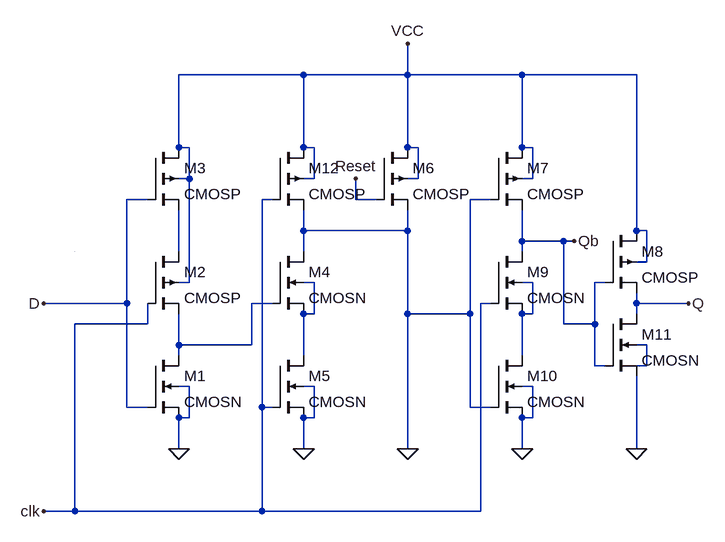
[diagram p0: schematic Draft6.asc]
Draft6.asc, the LTspice schematic file:
Version 4
SHEET 1 980 680
WIRE 352 -272 160 -272
WIRE 512 -272 512 -320
WIRE 512 -272 352 -272
WIRE 688 -272 512 -272
WIRE 864 -272 688 -272
WIRE 160 -160 160 -272
WIRE 176 -160 160 -160
WIRE 352 -160 352 -272
WIRE 368 -160 352 -160
WIRE 512 -160 512 -272
WIRE 528 -160 512 -160
WIRE 688 -160 688 -272
WIRE 704 -160 688 -160
WIRE 176 -112 176 -160
WIRE 176 -112 160 -112
WIRE 368 -112 368 -160
WIRE 368 -112 352 -112
WIRE 528 -112 528 -160
WIRE 528 -112 512 -112
WIRE 704 -112 704 -160
WIRE 704 -112 688 -112
WIRE 112 -80 80 -80
WIRE 304 -80 288 -80
WIRE 432 -80 432 -112
WIRE 464 -80 432 -80
WIRE 640 -80 608 -80
WIRE 352 -32 352 -64
WIRE 512 -32 512 -64
WIRE 512 -32 352 -32
WIRE 864 -32 864 -272
WIRE 880 -32 864 -32
WIRE 688 -16 688 -64
WIRE 752 -16 688 -16
WIRE 768 -16 752 -16
WIRE 160 0 160 -64
WIRE 352 0 352 -32
WIRE 688 0 688 -16
WIRE 880 16 880 -32
WIRE 880 16 864 16
WIRE 176 48 176 -112
WIRE 176 48 160 48
WIRE 368 48 352 48
WIRE 704 48 688 48
WIRE 816 48 800 48
WIRE 80 80 80 -80
WIRE 80 80 -48 80
WIRE 304 80 272 80
WIRE 640 80 624 80
WIRE 864 80 864 64
WIRE 944 80 864 80
WIRE 368 96 368 48
WIRE 368 96 352 96
WIRE 512 96 512 -32
WIRE 608 96 608 -80
WIRE 608 96 512 96
WIRE 704 96 704 48
WIRE 704 96 688 96
WIRE 864 96 864 80
WIRE 112 112 112 80
WIRE 112 112 0 112
WIRE 752 112 752 -16
WIRE 800 112 800 48
WIRE 800 112 752 112
WIRE 160 144 160 96
WIRE 272 144 272 80
WIRE 272 144 160 144
WIRE 880 144 864 144
WIRE 160 160 160 144
WIRE 352 160 352 96
WIRE 688 160 688 96
WIRE 800 176 800 112
WIRE 816 176 800 176
WIRE 880 176 880 144
WIRE 880 176 864 176
WIRE 176 208 160 208
WIRE 368 208 352 208
WIRE 704 208 688 208
WIRE 80 240 80 80
WIRE 112 240 80 240
WIRE 288 240 288 -80
WIRE 304 240 288 240
WIRE 608 240 608 96
WIRE 640 240 608 240
WIRE 176 256 176 208
WIRE 176 256 160 256
WIRE 368 256 368 208
WIRE 368 256 352 256
WIRE 704 256 704 208
WIRE 704 256 688 256
WIRE 160 304 160 256
WIRE 352 304 352 256
WIRE 512 304 512 96
WIRE 688 304 688 256
WIRE 864 304 864 192
WIRE 0 400 0 112
WIRE 0 400 -48 400
WIRE 288 400 288 240
WIRE 288 400 0 400
WIRE 624 400 624 80
WIRE 624 400 288 400
WIRE 0 0 0 0
FLAG -48 400 clk
FLAG 688 304 0
FLAG 160 304 0
FLAG 352 304 0
FLAG 512 304 0
FLAG 864 304 0
FLAG 512 -320 VCC
FLAG -48 80 D
FLAG 944 80 Q
FLAG 768 -16 Qb
FLAG 432 -112 Reset
SYMBOL cmosp 112 0 R0
SYMATTR InstName M2
SYMATTR Value2 l=180n w=1u
SYMBOL cmosp 112 -160 R0
SYMATTR InstName M3
SYMATTR Value2 l=180n w=1u
SYMBOL cmosn 112 160 R0
SYMATTR InstName M1
SYMATTR Value2 l=180n w=1u
SYMBOL cmosn 304 0 R0
SYMATTR InstName M4
SYMATTR Value2 l=180n w=1u
SYMBOL cmosn 304 160 R0
SYMATTR InstName M5
SYMATTR Value2 l=180n w=1u
SYMBOL cmosp 464 -160 R0
SYMATTR InstName M6
SYMATTR Value2 l=180n w=1u
SYMBOL cmosp 640 -160 R0
SYMATTR InstName M7
SYMATTR Value2 l=180n w=1u
SYMBOL cmosp 816 -32 R0
SYMATTR InstName M8
SYMATTR Value2 l=180n w=1u
SYMBOL cmosn 640 0 R0
SYMATTR InstName M9
SYMATTR Value2 l=180n w=1u
SYMBOL cmosn 640 160 R0
SYMATTR InstName M10
SYMATTR Value2 l=180n w=1u
SYMBOL cmosn 816 96 R0
SYMATTR InstName M11
SYMATTR Value2 l=180n w=1u
SYMBOL cmosp 304 -160 R0
SYMATTR InstName M12
SYMATTR Value2 l=180n w=1u

The netlist it stands for:
* Draft6.asc
M2 N001 clk N004 VCC CMOSP l=180n w=1u
M3 VCC D N001 VCC CMOSP l=180n w=1u
M1 N004 D 0 0 CMOSN l=180n w=1u
M4 0 N004 N002 N002 CMOSN l=180n w=1u
M5 N002 clk 0 0 CMOSN l=180n w=1u
M6 VCC Reset 0 VCC CMOSP l=180n w=1u
M7 VCC 0 Qb VCC CMOSP l=180n w=1u
M8 VCC Qb Q VCC CMOSP l=180n w=1u
M9 Qb clk N003 N003 CMOSN l=180n w=1u
M10 N003 0 0 0 CMOSN l=180n w=1u
M11 Q Qb 0 N005 CMOSN l=180n w=1u
M12 VCC clk 0 VCC CMOSP l=180n w=1u
.model NMOS NMOS
.model PMOS PMOS
.lib standard.mos
.backanno
.end